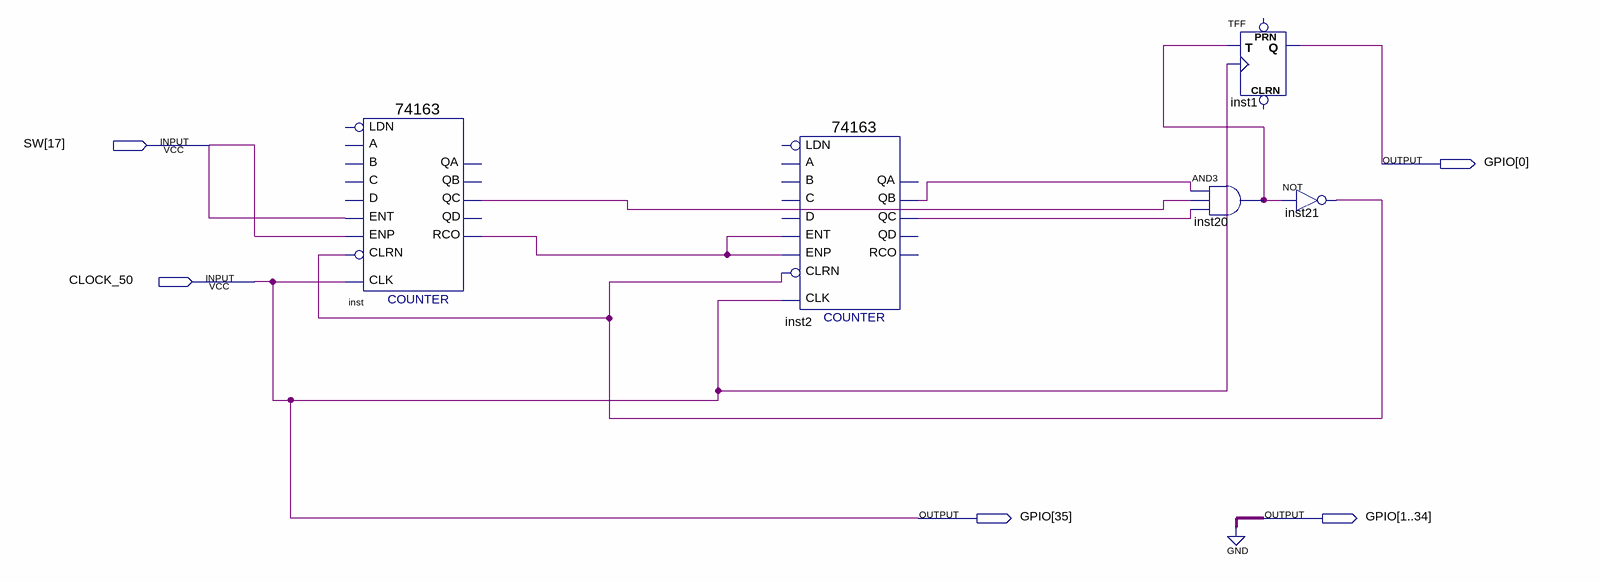
[diagram p0: schematic sheet]
// Quartus schematic Lab8.bdf as structural Verilog: 5 symbols, 5 pins
module Lab8 (
  input  [17:17] SW,
  input  CLOCK_50,
  output [0:35] GPIO
);

  wire inst2_qb, inst2_qc, inst20_out, inst21_out, inst_qc, inst_rco;

  \74163  inst (
    .ENT(SW[17]), .CLRN(inst21_out), .CLK(CLOCK_50), .ENP(SW[17]), .QC(inst_qc), .RCO(inst_rco));  // open: C, B, A, D, LDN, QA, QB, QD
  \74163  inst2 (
    .ENT(inst_rco), .CLRN(inst21_out), .CLK(CLOCK_50), .ENP(inst_rco), .QB(inst2_qb), .QC(inst2_qc));  // open: C, B, A, D, LDN, QA, QD, RCO
  and inst20 (inst20_out, inst2_qb, inst_qc, inst2_qc);
  TFF inst1 (.T(inst20_out), .CLK(CLOCK_50), .Q(GPIO[0]));  // open: PRN, CLRN
  not inst21 (inst21_out, inst20_out);

  assign GPIO[1:35] = {{34{1'b0}}, CLOCK_50};
endmodule
